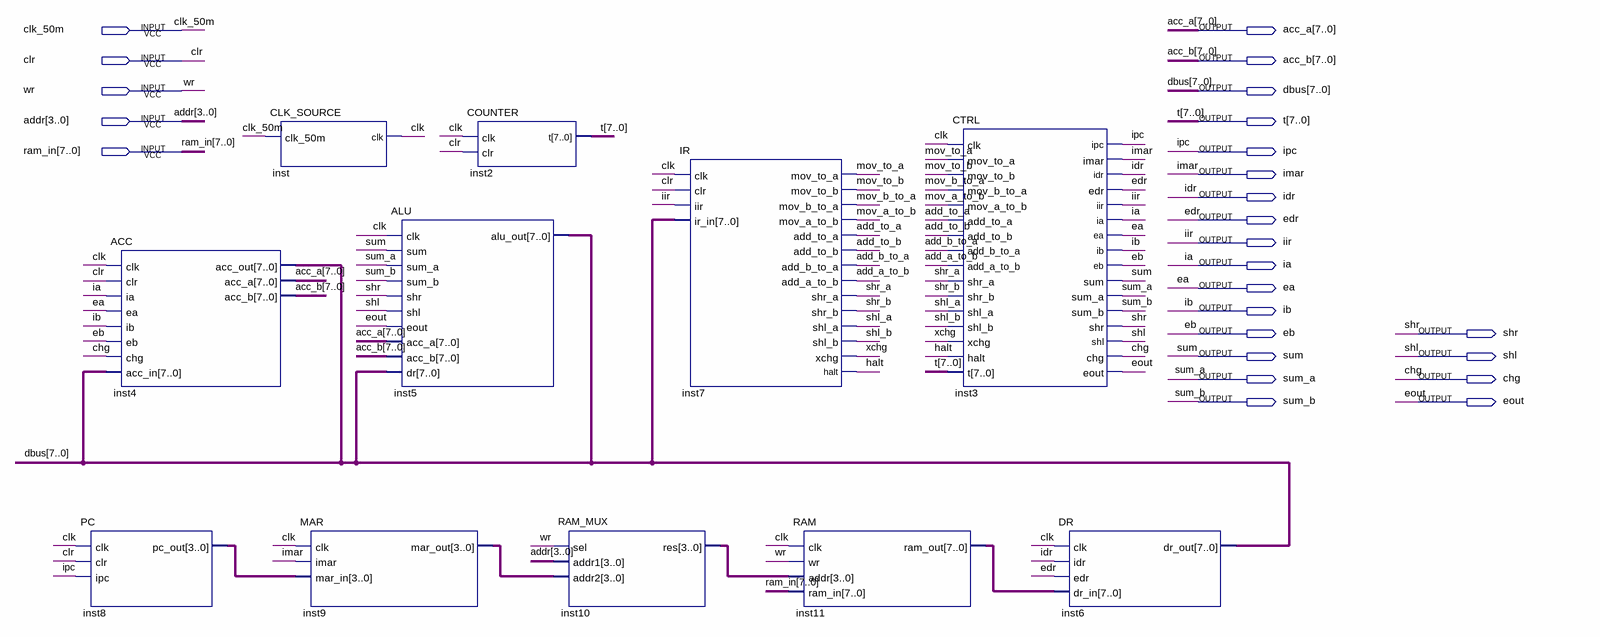
[diagram p0: schematic sheet]
// Quartus schematic AnalogCPU.bdf as structural Verilog: 11 symbols, 25 pins
module AnalogCPU (
  input  clk_50m,
  input  clr,
  input  wr,
  input  [3:0] addr,
  input  [7:0] ram_in,
  output [7:0] acc_a,
  output [7:0] acc_b,
  output [7:0] dbus,
  output [7:0] t,
  output ipc,
  output imar,
  output idr,
  output edr,
  output iir,
  output ia,
  output ea,
  output ib,
  output eb,
  output shr,
  output sum,
  output shl,
  output sum_a,
  output chg,
  output sum_b,
  output eout
);

  wire add_a_to_b, add_b_to_a, add_to_a, add_to_b, clk, halt, mov_a_to_b, mov_b_to_a, mov_to_a, mov_to_b,
       shl_a, shl_b, shr_a, shr_b, xchg;
  wire [3:0] inst8_pc_out, inst9_mar_out, inst10_res;
  wire [7:0] inst11_ram_out;

  ACC inst4 (
    .clk(clk), .clr(clr), .ia(ia), .ea(ea), .ib(ib), .eb(eb), .chg(chg), .acc_in(dbus), .acc_out(dbus),
    .acc_a(acc_a), .acc_b(acc_b));
  PC inst8 (.clk(clk), .clr(clr), .ipc(ipc), .pc_out(inst8_pc_out));
  CLK_SOURCE inst (.clk_50m(clk_50m), .clk(clk));
  MAR inst9 (.clk(clk), .imar(imar), .mar_in(inst8_pc_out), .mar_out(inst9_mar_out));
  ALU inst5 (
    .clk(clk), .sum(sum), .sum_a(sum_a), .sum_b(sum_b), .shr(shr), .shl(shl), .eout(eout), .acc_a(acc_a),
    .acc_b(acc_b), .dr(dbus), .alu_out(dbus));
  COUNTER inst2 (.clk(clk), .clr(clr), .t(t));
  RAM_MUX inst10 (.sel(wr), .addr1(addr), .addr2(inst9_mar_out), .res(inst10_res));
  IR inst7 (
    .clk(clk), .clr(clr), .iir(iir), .ir_in(dbus), .mov_to_a(mov_to_a), .mov_to_b(mov_to_b),
    .mov_b_to_a(mov_b_to_a), .mov_a_to_b(mov_a_to_b), .add_to_a(add_to_a), .add_to_b(add_to_b),
    .add_b_to_a(add_b_to_a), .add_a_to_b(add_a_to_b), .shr_a(shr_a), .shr_b(shr_b), .shl_a(shl_a),
    .shl_b(shl_b), .xchg(xchg), .halt(halt));
  RAM inst11 (.clk(clk), .wr(wr), .addr(inst10_res), .ram_in(ram_in), .ram_out(inst11_ram_out));
  CTRL inst3 (
    .clk(clk), .mov_to_a(mov_to_a), .mov_to_b(mov_to_b), .mov_b_to_a(mov_b_to_a), .mov_a_to_b(mov_a_to_b),
    .add_to_a(add_to_a), .add_to_b(add_to_b), .add_b_to_a(add_b_to_a), .add_a_to_b(add_a_to_b),
    .shr_a(shr_a), .shr_b(shr_b), .shl_a(shl_a), .shl_b(shl_b), .xchg(xchg), .halt(halt), .t(t), .ipc(ipc),
    .imar(imar), .idr(idr), .edr(edr), .iir(iir), .ia(ia), .ea(ea), .ib(ib), .eb(eb), .sum(sum),
    .sum_a(sum_a), .sum_b(sum_b), .shr(shr), .shl(shl), .chg(chg), .eout(eout));
  DR inst6 (.clk(clk), .idr(idr), .edr(edr), .dr_in(inst11_ram_out), .dr_out(dbus));
endmodule
